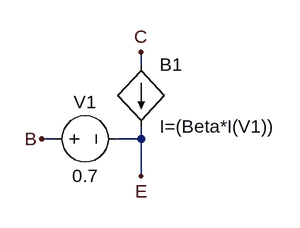
[diagram p0: schematic NPNActive.asc]
NPNActive.asc, the LTspice schematic file:
Version 4
SHEET 1 880 680
WIRE 240 80 240 64
WIRE 128 176 112 176
WIRE 240 176 240 160
WIRE 240 176 208 176
WIRE 240 224 240 176
FLAG 240 64 C
FLAG 240 224 E
FLAG 112 176 B
SYMBOL voltage 112 176 R270
WINDOW 0 32 56 VTop 2
WINDOW 3 -32 56 VBottom 2
WINDOW 123 0 0 Left 0
WINDOW 39 0 0 Left 0
SYMATTR InstName V1
SYMATTR Value 0.7
SYMBOL bi 240 80 R0
SYMATTR InstName B1
SYMATTR Value I=(Beta*I(V1))

The netlist it stands for:
* NPNActive.asc
V1 B E 0.7
B1 C E I=(Beta*I(V1))
.backanno
.end